# EAGLE design exp21dc (EAGLE 7.7.0)
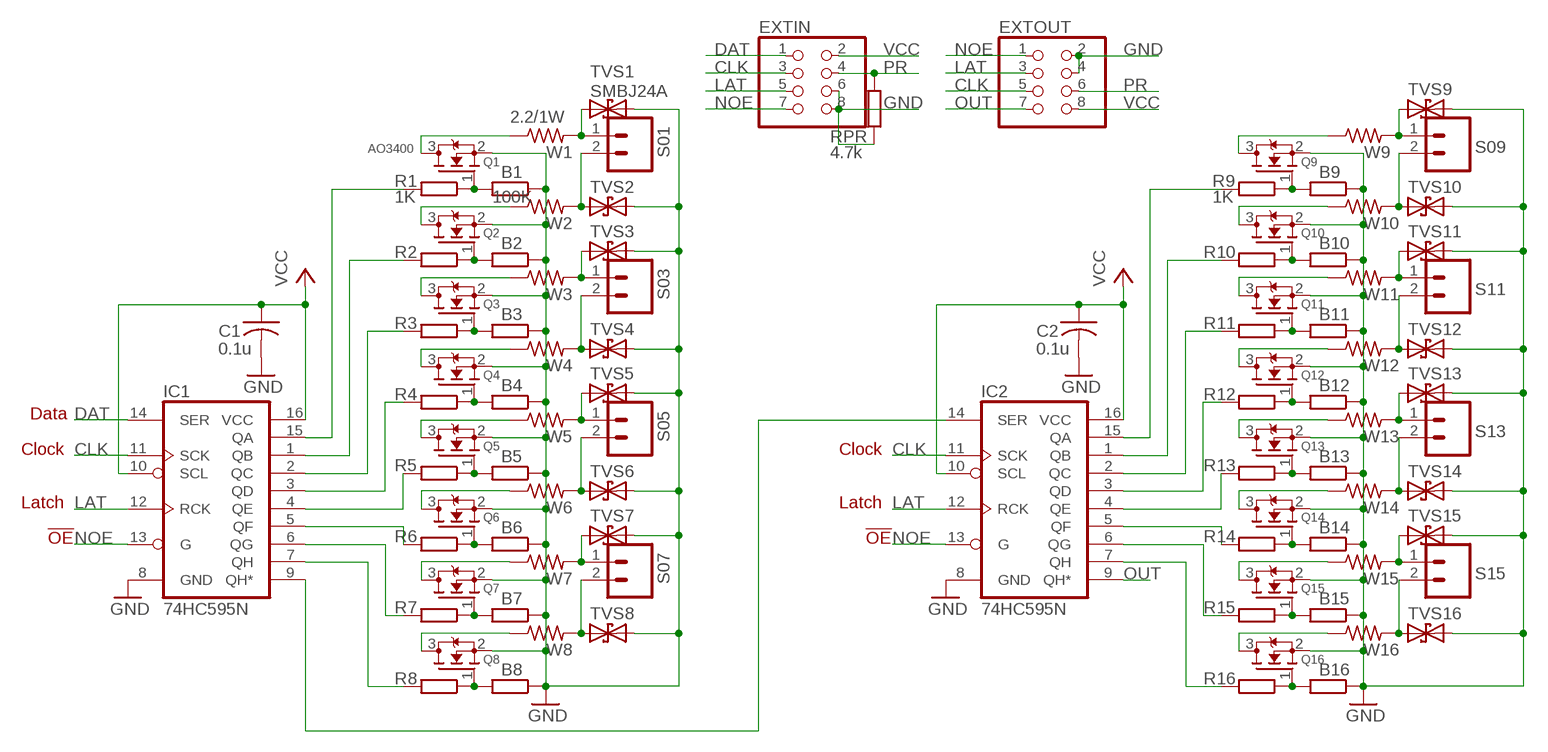
[diagram p0: schematic, sheet 1]

## Parts
B1  100K  R-EU_R0603  [R0603]
B2  100K  R-EU_R0603  [R0603]
B3  100K  R-EU_R0603  [R0603]
B4  100K  R-EU_R0603  [R0603]
B5  100K  R-EU_R0603  [R0603]
B6  100K  R-EU_R0603  [R0603]
B7  100K  R-EU_R0603  [R0603]
B8  100K  R-EU_R0603  [R0603]
B9  100K  R-EU_R0603  [R0603]
B10  100K  R-EU_R0603  [R0603]
B11  100K  R-EU_R0603  [R0603]
B12  100K  R-EU_R0603  [R0603]
B13  100K  R-EU_R0603  [R0603]
B14  100K  R-EU_R0603  [R0603]
B15  100K  R-EU_R0603  [R0603]
B16  100K  R-EU_R0603  [R0603]
C1  0.1u  C-USC0603K  [C0603K]
C2  0.1u  C-USC0603K  [C0603K]
EXTIN  PINHD-2X4/90  [2X04/90]
EXTOUT  PINHD-2X4/90  [2X04/90]
IC1  74HC595N  74LS595D  [SO16]
IC2  74HC595N  74LS595D  [SO16]
Q1  AO3400  MOSFET-NREFLOW  [SOT23]
Q2  MOSFET-NREFLOW  [SOT23]
Q3  MOSFET-NREFLOW  [SOT23]
Q4  MOSFET-NREFLOW  [SOT23]
Q5  MOSFET-NREFLOW  [SOT23]
Q6  MOSFET-NREFLOW  [SOT23]
Q7  MOSFET-NREFLOW  [SOT23]
Q8  MOSFET-NREFLOW  [SOT23]
Q9  MOSFET-NREFLOW  [SOT23]
Q10  MOSFET-NREFLOW  [SOT23]
Q11  MOSFET-NREFLOW  [SOT23]
Q12  MOSFET-NREFLOW  [SOT23]
Q13  MOSFET-NREFLOW  [SOT23]
Q14  MOSFET-NREFLOW  [SOT23]
Q15  MOSFET-NREFLOW  [SOT23]
Q16  MOSFET-NREFLOW  [SOT23]
R1  1K  R-EU_R0603  [R0603]
R2  1K  R-EU_R0603  [R0603]
R3  1K  R-EU_R0603  [R0603]
R4  1K  R-EU_R0603  [R0603]
R5  1K  R-EU_R0603  [R0603]
R6  1K  R-EU_R0603  [R0603]
R7  1K  R-EU_R0603  [R0603]
R8  1K  R-EU_R0603  [R0603]
R9  1K  R-EU_R0603  [R0603]
R10  1K  R-EU_R0603  [R0603]
R11  1K  R-EU_R0603  [R0603]
R12  1K  R-EU_R0603  [R0603]
R13  1K  R-EU_R0603  [R0603]
R14  1K  R-EU_R0603  [R0603]
R15  1K  R-EU_R0603  [R0603]
R16  1K  R-EU_R0603  [R0603]
RPR  4.7k  R-EU_R0603  [R0603]
S01  M025MM-X  [SCREWTERMINAL-5MM-2-X]
S03  M025MM-X  [SCREWTERMINAL-5MM-2-X]
S05  M025MM-X  [SCREWTERMINAL-5MM-2-X]
S07  M025MM-X  [SCREWTERMINAL-5MM-2-X]
S09  M025MM-X  [SCREWTERMINAL-5MM-2-X]
S11  M025MM-X  [SCREWTERMINAL-5MM-2-X]
S13  M025MM-X  [SCREWTERMINAL-5MM-2-X]
S15  M025MM-X  [SCREWTERMINAL-5MM-2-X]
TVS1  SMBJ24A  TVSSMB  [SMB]
TVS2  TVSSMB  [SMB]
TVS3  TVSSMB  [SMB]
TVS4  TVSSMB  [SMB]
TVS5  TVSSMB  [SMB]
TVS6  TVSSMB  [SMB]
TVS7  TVSSMB  [SMB]
TVS8  TVSSMB  [SMB]
TVS9  TVSSMB  [SMB]
TVS10  TVSSMB  [SMB]
TVS11  TVSSMB  [SMB]
TVS12  TVSSMB  [SMB]
TVS13  TVSSMB  [SMB]
TVS14  TVSSMB  [SMB]
TVS15  TVSSMB  [SMB]
TVS16  TVSSMB  [SMB]
W1  2.2/1W  R-US_R2512  [R2512]
W2  R-US_R2512  [R2512]
W3  R-US_R2512  [R2512]
W4  R-US_R2512  [R2512]
W5  R-US_R2512  [R2512]
W6  R-US_R2512  [R2512]
W7  R-US_R2512  [R2512]
W8  R-US_R2512  [R2512]
W9  R-US_R2512  [R2512]
W10  R-US_R2512  [R2512]
W11  R-US_R2512  [R2512]
W12  R-US_R2512  [R2512]
W13  R-US_R2512  [R2512]
W14  R-US_R2512  [R2512]
W15  R-US_R2512  [R2512]
W16  R-US_R2512  [R2512]

## Nets
CLK: EXTIN.3 EXTOUT.5 IC1.11(SCK) IC2.11(SCK)
DAT: EXTIN.1 IC1.14(SER)
GND: B1.1 B2.1 B3.1 B4.1 B5.1 B6.1 B7.1 B8.1 B9.1 B10.1 B11.1 B12.1 B13.1 B14.1 B15.1 B16.1 C1.2 C2.2 EXTIN.6 EXTIN.8 EXTOUT.2 EXTOUT.4 IC1.8(GND) IC2.8(GND) Q1.2(S) Q2.2(S) Q3.2(S) Q4.2(S) Q5.2(S) Q6.2(S) Q7.2(S) Q8.2(S) Q9.2(S) Q10.2(S) Q11.2(S) Q12.2(S) Q13.2(S) Q14.2(S) Q15.2(S) Q16.2(S) RPR.1 TVS1.C TVS2.C TVS3.C TVS4.C TVS5.C TVS6.C TVS7.C TVS8.C TVS9.C TVS10.C TVS11.C TVS12.C TVS13.C TVS14.C TVS15.C TVS16.C
LAT: EXTIN.5 EXTOUT.3 IC1.12(RCK) IC2.12(RCK)
N$1 [power]: S01.1 TVS1.A W1.2
N$2 [power]: S03.1 TVS3.A W3.2
N$3 [power]: S05.1 TVS5.A W5.2
N$4: IC1.5(QF) R6.2
N$5: IC1.6(QG) R7.2
N$6 [power]: S07.1 TVS7.A W7.2
N$7: IC1.7(QH) R8.2
N$8: B1.2 Q1.1(G) R1.1
N$9 [power]: Q1.3(D) W1.1
N$10: IC1.4(QE) R5.2
N$11: IC1.3(QD) R4.2
N$12: IC1.2(QC) R3.2
N$13: IC1.1(QB) R2.2
N$14: IC1.15(QA) R1.2
N$15: B2.2 Q2.1(G) R2.1
N$16 [power]: Q2.3(D) W2.1
N$17 [power]: S01.2 TVS2.A W2.2
N$18: B3.2 Q3.1(G) R3.1
N$19 [power]: Q3.3(D) W3.1
N$20 [power]: S03.2 TVS4.A W4.2
N$21: B4.2 Q4.1(G) R4.1
N$22 [power]: Q4.3(D) W4.1
N$23 [power]: S05.2 TVS6.A W6.2
N$24: IC2.5(QF) R14.2
N$25 [power]: S07.2 TVS8.A W8.2
N$26: IC2.6(QG) R15.2
N$27: IC2.7(QH) R16.2
N$28: IC2.4(QE) R13.2
N$29: IC2.3(QD) R12.2
N$30: IC2.2(QC) R11.2
N$31: IC2.1(QB) R10.2
N$32: IC2.15(QA) R9.2
N$33 [power]: S09.2 TVS10.A W10.2
N$34 [power]: S11.2 TVS12.A W12.2
N$35 [power]: S13.2 TVS14.A W14.2
N$36 [power]: S15.2 TVS16.A W16.2
N$37 [power]: S09.1 TVS9.A W9.2
N$38: S11.1 TVS11.A W11.2
N$39: S13.1 TVS13.A W13.2
N$40: S15.1 TVS15.A W15.2
N$41: B9.2 Q9.1(G) R9.1
N$42: B10.2 Q10.1(G) R10.1
N$43: B11.2 Q11.1(G) R11.1
N$44: B12.2 Q12.1(G) R12.1
N$45: B13.2 Q13.1(G) R13.1
N$46: B14.2 Q14.1(G) R14.1
N$47: B15.2 Q15.1(G) R15.1
N$48: B16.2 Q16.1(G) R16.1
N$49: IC1.9(QH*) IC2.14(SER)
N$50: B5.2 Q5.1(G) R5.1
N$51: B6.2 Q6.1(G) R6.1
N$52: B7.2 Q7.1(G) R7.1
N$53: B8.2 Q8.1(G) R8.1
N$54 [power]: Q5.3(D) W5.1
N$55 [power]: Q6.3(D) W6.1
N$56 [power]: Q7.3(D) W7.1
N$57 [power]: Q8.3(D) W8.1
N$58 [power]: Q9.3(D) W9.1
N$59 [power]: Q10.3(D) W10.1
N$60: Q11.3(D) W11.1
N$61 [power]: Q12.3(D) W12.1
N$62: Q13.3(D) W13.1
N$63 [power]: Q14.3(D) W14.1
N$64: Q15.3(D) W15.1
N$65 [power]: Q16.3(D) W16.1
NOE: EXTIN.7 EXTOUT.1 IC1.13(G) IC2.13(G)
OUT: EXTOUT.7 IC2.9(QH*)
PR: EXTIN.4 EXTOUT.6 RPR.2
VCC: C1.1 C2.1 EXTIN.2 EXTOUT.8 IC1.10(SCL) IC1.16(VCC) IC2.10(SCL) IC2.16(VCC)

## Notes on the sheet
- Data
- Clock | Clock
- Latch | Latch
- !OE | !OE

## Library data of the parts
B1-B16 R1-R16 RPR = rcl:R-EU_: RESISTOR, European symbol
C1 C2 = adafruit2013:C-US: CAPACITOR, American symbol
EXTIN EXTOUT = pinhead:PINHD-2X4: PIN HEADER
IC1 IC2 = SparkFun:74*595: 8-bit SHIFT REGISTER, output latch
Q1-Q16 = adafruit2013:MOSFET-N: N-Channel Mosfet 2N7002E - 60V 260mA SOT23 [Digikey: 2N7002ET1GOSTR-ND] - REEL BSH103 - 30V 850mA SOT23 [Digikey: 568-5013-1-ND]
S01 S03 S05 S07 S09 S11 S13 S15 = SparkFun:M02: Header 2 Standard 2-pin 0.1" header. Use with straight break away headers (SKU : PRT-00116), right angle break away headers (PRT-00553), swiss pins (PRT-00743), machine pins (PRT-00117), and female headers (PRT-00115). Molex polarized connector foot print use with SKU : PRT-08233 with associated crimp pins and housings.
TVS1-TVS16 = SparkFunNew:TVS
W1-W16 = resistor:R-US_: RESISTOR, American symbol

## Net classes
0 default: width 0.254 mm, clearance 0.203 mm
1 power: width 0.508 mm, clearance 0.203 mm

## Board
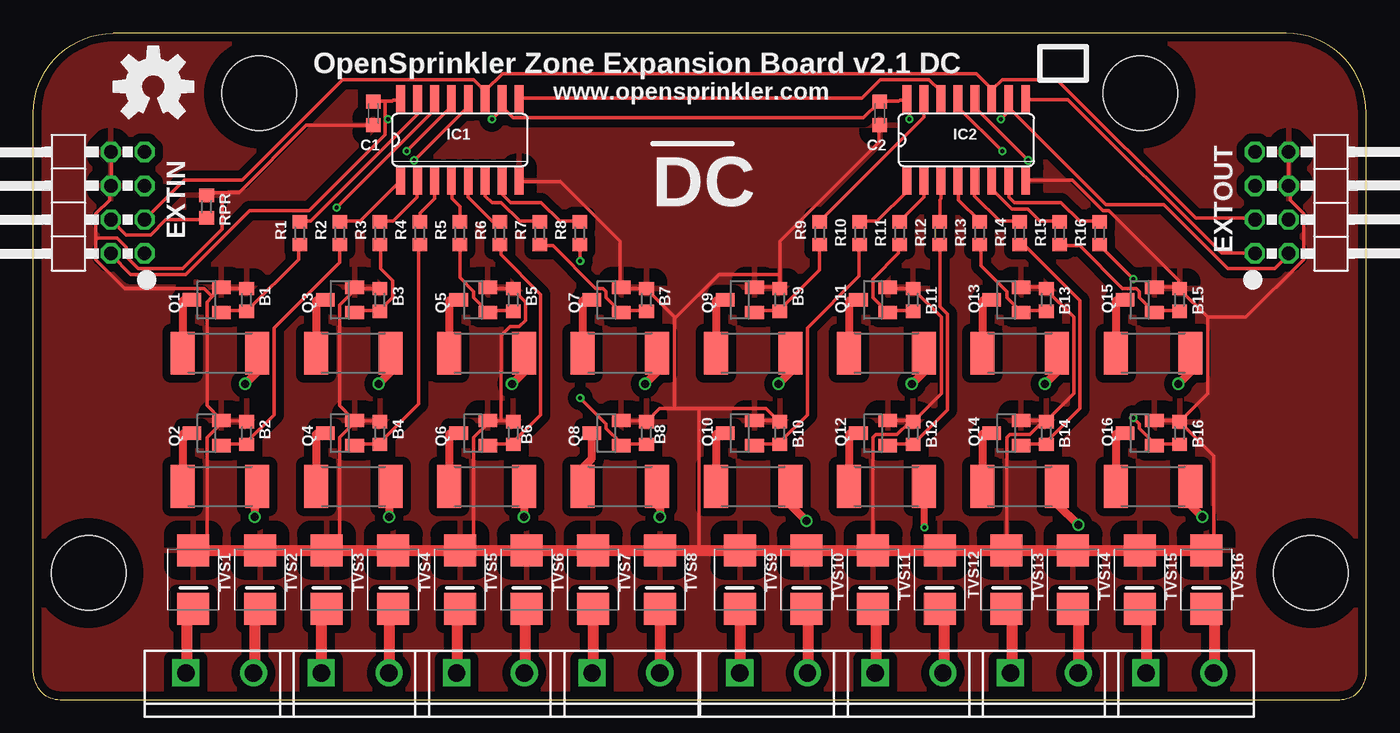
[diagram p1: board, top side]
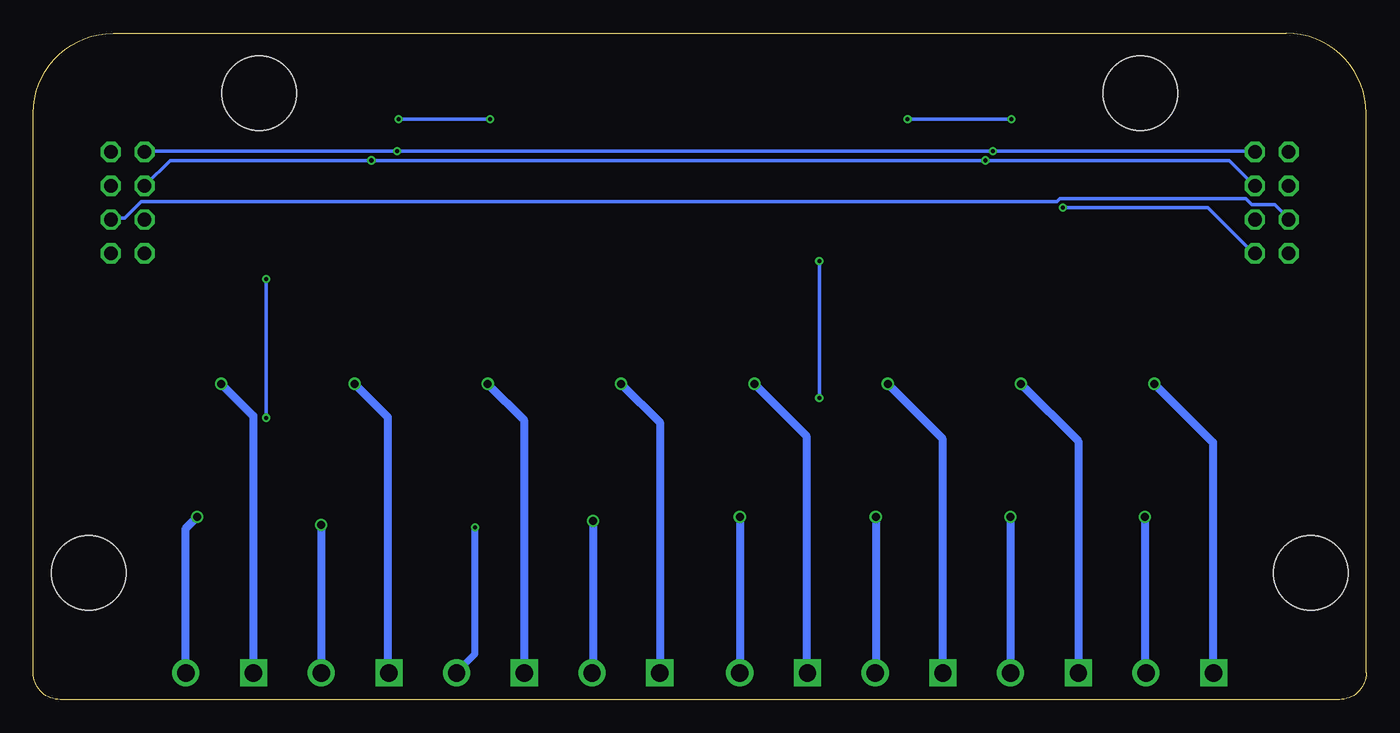
[diagram p2: board, bottom side, seen from below]

Size 100 x 50 mm. Coordinates in mm from the lower left corner, seen from the top.
Outline: 2,0 98,0 arc90 100,2 100,44 arc90 94,50 6,50 arc90 0,44 0,2 arc90 2,0
Copper layers (1*16): Top 0.035mm / dielectric 1.5mm / Bottom 0.035mm
Design rules "Fusion_eagle_rule_v1.1 *": minimum track width 6mil, minimum drill 12mil, track to track 6mil, track to pad 6mil, pad to pad 6mil, via to via 6mil, smd to smd 0mil, copper to edge 10mil, drill to drill 10mil, minimum pad ring 10mil, minimum via ring 6mil, stop-mask expansion 2mil, vias tented up to drill 100mil, thermal gap 40mil
Holes 5.6 mm at 4.14,9.49 95.86,9.49 16.95,45.49 83.06,45.49
tRestrict: area 0.6,6 to 7.6,13; area 92.4,6 to 99.4,13; area 13.4,42 to 20.4,49; area 79.6,42 to 86.6,49

### Footprints (pad centres in the part's own frame; a part is rotated, then mirrored left to right if it is on the bottom)
R0603 = smd 1 x 1.1: 1 -0.85,0; 2 0.85,0
C0603K = smd 1.05 x 1.08: 1 -0.875,0; 2 0.875,0
2X04/90 = drill 1.016 octagon: 1 -3.81,-6.35; 2 -3.81,-3.81; 3 -1.27,-6.35; 4 -1.27,-3.81; 5 1.27,-6.35; 6 1.27,-3.81; 7 3.81,-6.35; 8 3.81,-3.81
SO16 = smd 0.66 x 2.032: 1 -4.445,-3.073; 2 -3.175,-3.073; 3 -1.905,-3.073; 4 -0.635,-3.073; 5 0.635,-3.073; 6 1.905,-3.073; 7 3.175,-3.073; 8 4.445,-3.073; 9 4.445,3.073; 10 3.175,3.073; 11 1.905,3.073; 12 0.635,3.073; 13 -0.635,3.073; 14 -1.905,3.073; 15 -3.175,3.073; 16 -4.445,3.073
SOT23 = smd 1 x 1.4: 1 -0.95,-1.1; 2 0.95,-1.1; 3 0,1.1
SCREWTERMINAL-5MM-2-X = drill 1.3 pad 2.032 square: 1 0,0 | drill 1.3 pad 2.032: 2 5.08,0
SMB = smd 2.4 x 2.4: A 2.2,0; C -2.2,0
R2512 = smd 1.8 x 3.2: 1 -2.8,0; 2 2.8,0

### Placement (x,y rotation side)
B1  16,30 270 top
B2  16,20 270 top
B3  26,30 270 top
B4  26,20 270 top
B5  36,30 270 top
B6  36,20 270 top
B7  46,30 270 top
B8  46,20 270 top
B9  56,30 270 top
B10  56,20 270 top
B11  66,30 270 top
B12  66,20 270 top
B13  76,30 270 top
B14  76,20 270 top
B15  86,30 270 top
B16  86,20 270 top
C1  25.5,44 270 top
C2  63.5,44 270 top
EXTIN  2,37.29 90 top
EXTOUT  98,37.29 270 top
IC1  32,42 0 top
IC2  70,42 0 top
Q1  13,30 90 top
Q2  13,20 90 top
Q3  23,30 90 top
Q4  23,20 90 top
Q5  33,30 90 top
Q6  33,20 90 top
Q7  43,30 90 top
Q8  43,20 90 top
Q9  53,30 90 top
Q10  53,20 90 top
Q11  63,30 90 top
Q12  63,20 90 top
Q13  73,30 90 top
Q14  73,20 90 top
Q15  83,30 90 top
Q16  83,20 90 top
R1  20,35 90 top
R2  23,35 90 top
R3  26,35 90 top
R4  29,35 90 top
R5  32,35 90 top
R6  35,35 90 top
R7  38,35 90 top
R8  41,35 90 top
R9  59,35 90 top
R10  62,35 90 top
R11  65,35 90 top
R12  68,35 90 top
R13  71,35 90 top
R14  74,35 90 top
R15  77,35 90 top
R16  80,35 90 top
RPR  13,37 270 top
S01  11.44,2 0 top
S03  21.6,2 0 top
S05  31.76,2 0 top
S07  41.92,2 0 top
S09  53,2 0 top
S11  63.16,2 0 top
S13  73.32,2 0 top
S15  83.48,2 0 top
TVS1  12,9 270 top
TVS2  17,9 270 top
TVS3  22,9 270 top
TVS4  27,9 270 top
TVS5  32,9 270 top
TVS6  37,9 270 top
TVS7  42,9 270 top
TVS8  47,9 270 top
TVS9  53,9 270 top
TVS10  58,9 270 top
TVS11  63,9 270 top
TVS12  68,9 270 top
TVS13  73,9 270 top
TVS14  78,9 270 top
TVS15  83,9 270 top
TVS16  88,9 270 top
W1  14,26 0 top
W2  14,16 0 top
W3  24,26 0 top
W4  24,16 0 top
W5  34,26 0 top
W6  34,16 0 top
W7  44,26 0 top
W8  44,16 0 top
W9  54,26 0 top
W10  54,16 0 top
W11  64,26 0 top
W12  64,16 0 top
W13  74,26 0 top
W14  74,16 0 top
W15  84,26 0 top
W16  84,16 0 top

### Tracks (layer width: path | path; a pad name or v marks a point on that pad's centre or on a via)
CLK
  Top 0.254: EXTOUT.5 91.55,36.12 87.21,36.12 76.81,46.52 72.69,46.52 72.01,45.83 72.01,45.15 IC2.11 71.89,45.83 70.75,46.98 35.2,46.98 33.95,45.72 IC1.11 33.83,45.15 33.83,45.72 33.03,46.52 23.2,46.52 15.66,38.98 11.32,38.98 8.46,36.12 EXTIN.3
DAT  (via drill 0.3)
  Top 0.254: v22.75,36.92 30.06,44.23 30.06,45.03 IC1.14
  Bottom 0.254: v22.75,36.92 11.89,36.92 8.46,33.49 EXTIN.1
GND
  Top 0.254: 56.01,31.89 56.01,30.86 B9.1 56,30.95 Q9.2 | 56.01,31.89 56.01,34.4 63.44,41.83 63.44,43.09 C2.2 | Q8.2 44.12,20.92 45.95,20.92 B8.1 46.06,20.92 46.98,21.83 48.12,21.83 | 48.12,21.83 49.95,21.83 | 49.95,21.83 54.98,21.83 55.89,20.92 B10.1 56,20.95 Q10.2 | 48.12,28.69 46.06,30.75 B7.1 45.95,30.86 44.12,30.86 Q7.2 44.01,30.98 44.01,34.4 39.55,38.86 36.46,38.86 IC1.8 | 48.12,21.83 48.12,28.69 | 56.01,31.89 51.44,31.89 48.23,28.69 48.12,28.69 | 14.17,38.06 13.03,38.06 RPR.1 | 14.17,38.06 15.43,38.06 20.46,43.09 25.49,43.09 C1.2 | EXTOUT.2 94.18,41.03 94.18,38.63 EXTOUT.4 94.3,38.52 94.3,37.49 95.33,36.46 95.33,33.03 90.98,28.69 88.12,28.69 | EXTIN.8 5.83,41.03 5.83,38.63 EXTIN.6 5.71,38.52 5.71,37.49 4.69,36.46 4.69,34.63 | 74.52,38.98 IC2.8 74.64,38.98 77.95,38.98 80.24,36.69 80.7,36.69 85.95,31.43 85.95,30.86 B15.1 | Q5.2 34.18,30.86 35.89,30.86 B5.1 36.01,30.75 36.92,29.83 36.92,28.46 36.46,28 35.78,28 35.09,27.32 35.09,20.92 | B3.1 25.95,30.86 24.12,30.86 Q3.2 24.12,30.75 22.97,29.6 22.97,22.06 24,21.03 Q4.2 | 35.09,20.92 34.18,20.92 Q6.2 34.18,20.8 33.03,19.66 33.03,11.54 TVS5.C | 35.09,20.92 35.89,20.92 B6.1 | B4.1 25.95,20.92 24.12,20.92 Q4.2 | B1.1 15.89,30.86 14.17,30.86 Q1.2 14.06,30.86 13.43,30.23 | B2.1 15.89,20.92 14.17,20.92 Q2.2 | B12.1 65.95,20.8 65.72,20.8 64.81,19.89 63.21,19.89 62.98,19.66 62.98,11.54 TVS11.C | B14.1 75.89,20.8 75.67,20.8 74.75,19.89 73.27,19.89 73.04,19.66 73.04,11.54 TVS13.C | B16.1 86.07,20.8 88.58,18.29 88.58,12 88.12,11.54 TVS16.C 88.01,11.4 | B12.1 66.06,20.92 68.12,22.97 68.12,28.69 66.06,30.75 B11.1 65.95,30.86 64.12,30.86 Q11.2
  Top 0.254: B14.1 76.01,20.92 78.07,22.97 78.07,28.69 76.01,30.75 B13.1 76,30.95 Q13.2 | 88.12,28.69 86.07,30.75 B15.1 | 88.12,28.69 88.12,22.97 86.07,20.92 B16.1 | Q2.2 14.17,20.8 13.03,19.66 13.03,11.54 TVS1.C | 13.43,30.23 13.03,29.83 13.03,22.06 14.06,21.03 Q2.2 | Q4.2 24.12,20.8 22.97,19.66 22.97,11.54 TVS3.C | 4.69,34.63 4.69,33.03 6.86,30.86 12.8,30.86 13.43,30.23 | 14.17,38.06 14.17,35.32 11.2,32.35 7.89,32.35 6.97,33.26 6.97,33.95 6.29,34.63 4.69,34.63 | 49.95,11.2 49.95,21.83 | Q12.2 66,20.95 B12.1 | Q14.2 76,20.95 B14.1 | Q15.2 86,30.95 B15.1 | Q16.2 86,20.95 B16.1
  Top 0.813: TVS1.C TVS2.C TVS3.C TVS4.C TVS5.C TVS6.C TVS7.C TVS8.C 49.95,11.2 TVS9.C TVS10.C TVS11.C TVS12.C TVS13.C TVS14.C TVS15.C TVS16.C
  pour Top (isolate 0.61): 0,50 100,50 100,0 0,0
LAT  (via drill 0.3)
  Top 0.254: v74.64,40.46 70.64,44.46 70.64,45.03 IC2.12 | v28.57,40.46 32.58,44.46 32.58,45.03 IC1.12
  Bottom 0.254: EXTOUT.3 91.55,38.63 89.72,40.46 v74.64,40.46 v28.57,40.46 10.29,40.46 8.46,38.63 EXTIN.5
N$1  (via drill 0.6)
  Top 0.61: v15.9,23.7 16.8,24.6 W1.2
  Top 0.813: TVS1.A 11.6,6.8 11.5,6.7 11.5,2 S01.1
  Bottom 0.61: v15.9,23.7 11.5,19.3 11.5,2 S01.1
N$2  (via drill 0.6)
  Top 0.61: v25.9,23.7 26.8,24.6 W3.2
  Top 0.813: S03.1 21.6,6.7 21.7,6.8 TVS3.A
  Bottom 0.61: S03.1 21.6,19.4 v25.9,23.7
N$3  (via drill 0.6)
  Top 0.61: v35.9,23.7 36.8,24.6 W5.2
  Top 0.813: TVS5.A 31.9,6.8 31.8,6.7 31.8,2 S05.1
  Bottom 0.61: v35.9,23.7 31.8,19.6 31.8,2 S05.1
N$4
  Top 0.254: R6.2 35,35.9 34.4,35.9 32.6,37.7 32.6,38.9 IC1.5
N$5
  Top 0.254: R7.2 38,35.9 36.5,35.9 35.1,37.3 34.4,37.3 33.9,37.8 33.9,38.9 IC1.6
N$6  (via drill 0.6)
  Top 0.61: v45.9,23.7 46.8,24.6 W7.2
  Top 0.813: TVS7.A 42,2 S07.1
  Bottom 0.61: v45.9,23.7 42,19.8 42,2 S07.1
N$7
  Top 0.254: R8.2 41,35.9 39.5,35.9 38.1,37.3 35.8,37.3 35.2,37.9 35.2,38.9 IC1.7
N$8
  Top 0.254: Q1.1 14.1,29.1 14.5,29.1 14.6,29.2 16,29.2 B1.2 16.12,29.26 19.89,33.03 19.89,34.06 R1.1
N$9
  Top 0.61: W1.1 11.2,29.9 11.3,30 Q1.3
N$10
  Top 0.254: R5.2 32,37 31.4,37.6 31.4,38.9 IC1.4
N$11
  Top 0.254: R4.2 29,36.5 30.1,37.6 30.1,38.9 IC1.3
N$12
  Top 0.254: R3.2 26,35.9 27,35.9 28.8,37.7 28.8,38.9 IC1.2
N$13
  Top 0.254: R2.2 23,35.9 24.5,35.9 27.5,38.9 IC1.1
N$14
  Top 0.254: R1.2 20,35.9 20.8,35.9 28.8,43.9 28.8,45 IC1.15
N$15
  Top 0.254: Q2.1 14.1,19.1 14.5,19.1 14.6,19.2 16,19.2 B2.2 16,19.32 18.06,21.37 18.06,27.89 22.97,32.8 22.97,34.06 R2.1
N$16
  Top 0.61: W2.1 11.2,19.9 11.3,20 Q2.3
N$17  (via drill 0.6)
  Top 0.61: v16.6,13.7 16.6,14.4 16.8,14.6 W2.2
  Top 0.813: TVS2.A 16.7,6.8 16.6,6.7 16.6,2 S01.2
  Bottom 0.61: v16.6,13.7 16.6,2 S01.2
N$18
  Top 0.254: Q3.1 24.1,29.1 24.5,29.1 24.6,29.2 26,29.2 B3.2 26.06,29.26 26.98,30.18 26.98,31.43 26.06,32.35 26.06,34.06 R3.1
N$19
  Top 0.61: W3.1 21.2,29.9 21.3,30 Q3.3
N$20  (via drill 0.6)
  Top 0.61: v26.7,13.7 26.7,14.5 26.8,14.6 W4.2
  Top 0.813: TVS4.A 26.8,6.8 26.7,6.7 26.7,2 S03.2
  Bottom 0.61: v26.7,13.7 26.7,2 S03.2
N$21
  Top 0.254: Q4.1 24.1,19.1 24.5,19.1 24.6,19.2 26,19.2 B4.2 26.06,19.32 28.92,22.17 28.92,34.06 R4.1
N$22
  Top 0.61: W4.1 21.2,19.9 21.3,20 Q4.3
N$23  (via drill 0.6)
  Top 0.61: W6.2 v36.8,13.7
  Top 0.813: TVS6.A 36.9,6.8 36.9,2 S05.2
  Bottom 0.61: v36.8,13.7 36.8,2 S05.2
N$24
  Top 0.254: R14.2 74,35.9 72.5,35.9 70.6,37.8 70.6,38.9 IC2.5
N$25  (via drill 0.6)
  Top 0.61: v47,13.7 47,14.4 46.8,14.6 W8.2
  Top 0.813: TVS8.A S07.2
  Bottom 0.61: v47,13.7 S07.2
N$26
  Top 0.254: R15.2 77,35.9 75.5,35.9 74.6,36.8 73.4,36.8 71.9,38.3 71.9,38.9 IC2.6
N$27
  Top 0.254: R16.2 80,35.9 78.5,35.9 77.1,37.3 73.6,37.3 73.2,37.7 73.2,38.9 IC2.7
N$28
  Top 0.254: R13.2 71,35.9 69.4,37.5 69.4,38.9 IC2.4
N$29
  Top 0.254: R12.2 68,37.5 68.1,37.6 68.1,38.9 IC2.3
N$30
  Top 0.254: R11.2 65,35.9 66.8,37.7 66.8,38.9 IC2.2
N$31
  Top 0.254: R10.2 62,35.9 63.3,35.9 65.6,38.2 65.6,38.9 IC2.1
N$32
  Top 0.254: R9.2 59,35.9 66.8,43.7 66.8,45 IC2.15
N$33  (via drill 0.6)
  Top 0.61: v58,13.4 56.8,14.6 W10.2
  Top 0.813: TVS10.A 58.1,6.8 58.1,2 S09.2
  Bottom 0.61: v58,13.4 58,2 S09.2
N$34  (via drill 0.3)
  Top 0.508: v66.86,12.92 66.86,15.89 W12.2
  Top 0.813: TVS12.A 68.2,6.8 68.3,6.7 68.3,2 S11.2
  Bottom 0.508: v66.86,12.92 66.86,3.43 68.24,2.06 S11.2
N$35  (via drill 0.6)
  Top 0.61: v78.4,13.1 76.8,14.7 W14.2
  Top 0.813: S13.2 78.4,6.7 78.3,6.8 TVS14.A
  Bottom 0.61: v78.4,13.1 S13.2
N$36  (via drill 0.6)
  Top 0.61: v87.7,13.7 86.8,14.6 W16.2
  Top 0.813: TVS16.A 88.5,6.8 88.6,6.7 88.6,2 S15.2
  Bottom 0.61: v87.7,13.7 88.6,12.8 88.6,2.04 S15.2
N$37  (via drill 0.6)
  Top 0.61: v55.9,23.7 56.8,24.6 W9.2
  Top 0.813: TVS9.A S09.1
  Bottom 0.61: S09.1 53,20.8 v55.9,23.7
N$38  (via drill 0.6)
  Top 0.61: v65.9,23.7 66.8,24.6 W11.2
  Top 0.813: TVS11.A 63.1,6.8 63.2,6.7 63.2,2 S11.1
  Bottom 0.61: v65.9,23.7 63.2,21 63.2,2 S11.1
N$39  (via drill 0.6)
  Top 0.61: v75.9,23.7 76.8,24.6 W13.2
  Top 0.813: TVS13.A 73.3,6.8 73.4,6.7 73.4,2 S13.1
  Bottom 0.61: v75.9,23.7 73.4,21.2 73.4,2 S13.1
N$40  (via drill 0.6)
  Top 0.61: v85.9,23.7 86.8,24.6 W15.2
  Top 0.813: TVS15.A 83.4,6.8 83.5,6.7 83.5,2 S15.1
  Bottom 0.61: v85.9,23.7 83.5,21.3 83.5,2 S15.1
N$41
  Top 0.254: Q9.1 54.1,29.1 54.5,29.1 54.6,29.2 56,29.2 B9.2 56.01,29.26 58.98,32.23 58.98,34.06 R9.1
N$42
  Top 0.254: Q10.1 54.1,19.1 54.5,19.1 54.6,19.2 56,19.2 B10.2 56.01,19.32 58.06,21.37 58.06,27.89 61.95,31.77 61.95,34.06 R10.1
N$43
  Top 0.254: B11.2 66,29.2 64.6,29.2 64.5,29.1 64.1,29.1 Q11.1 64.01,29.15 62.98,30.18 62.98,31.55 64.92,33.49 64.92,34.06 R11.1
N$44
  Top 0.254: Q12.1 64.1,19.1 64.5,19.1 64.6,19.2 66,19.2 B12.2 66.06,19.2 68.58,21.72 68.58,28.92 68.01,29.49 68.01,34.06 R12.1
N$45
  Top 0.254: B13.2 76,29.2 74.6,29.2 74.5,29.1 74.1,29.1 Q13.1 74.07,29.15 73.04,30.18 73.04,30.63 71.09,32.58 71.09,34.06 R13.1
N$46
  Top 0.254: Q14.1 74.1,19.1 74.5,19.1 74.6,19.2 76,19.2 B14.2 76.01,19.32 78.52,21.83 78.52,29.95 74.41,34.06 74.07,34.06 R14.1
N$47
  Top 0.254: B15.2 86,29.2 84.6,29.2 84.5,29.1 84.1,29.1 Q15.1 84.01,29.15 82.98,30.18 82.98,30.63 82.75,30.86 81.72,30.86 78.52,34.06 77.04,34.06 R15.1
N$48  (via drill 0.3)
  Top 0.254: B16.2 86,19.2 84.6,19.2 84.5,19.1 84.1,19.1 Q16.1 84.12,19.2 82.98,20.34 82.98,20.69 v82.53,21.14 | v82.53,31.55 80.01,34.06 R16.1
  Bottom 0.254: v82.53,21.14 v82.53,31.55
N$49
  Top 0.254: IC1.9 36.46,45.15 62.18,45.15 63.55,46.52 67.21,46.52 68.01,45.72 68.01,45.15 IC2.14
N$50
  Top 0.254: B5.2 36,29.2 34.6,29.2 34.5,29.1 34.1,29.1 Q5.1 34.06,29.15 33.03,30.18 33.03,30.63 32,31.66 32,34.06 R5.1
N$51
  Top 0.254: Q6.1 34.1,19.1 34.5,19.1 34.6,19.2 36,19.2 B6.2 36.01,19.32 38.06,21.37 38.06,30.4 35.09,33.38 35.09,34.06 R6.1
N$52
  Top 0.254: B7.2 46,29.2 44.6,29.2 44.5,29.1 44.1,29.1 Q7.1 44.01,29.15 42.98,30.18 42.98,30.63 42.75,30.86 42.18,30.86 38.98,34.06 38.06,34.06 R7.1
N$53  (via drill 0.3)
  Top 0.254: B8.2 46,19.2 44.6,19.2 44.5,19.1 44.1,19.1 Q8.1 44.12,19.2 42.98,20.34 42.98,20.69 v41.03,22.63 | v41.03,32.92 41.03,34.06 R8.1
  Bottom 0.254: v41.03,22.63 v41.03,32.92
N$54
  Top 0.61: W5.1 31.2,29.9 31.3,30 Q5.3
N$55
  Top 0.61: W6.1 31.2,19.9 31.3,20 Q6.3
N$56
  Top 0.61: W7.1 41.2,29.9 41.3,30 Q7.3
N$57
  Top 0.61: Q8.3 41.9,18.1 41.2,17.4 W8.1
N$58
  Top 0.61: W9.1 51.2,29.9 51.3,30 Q9.3
N$59
  Top 0.61: W10.1 51.2,19.9 51.3,20 Q10.3
N$60
  Top 0.61: W11.1 61.2,29.9 61.3,30 Q11.3
N$61
  Top 0.61: W12.1 61.2,19.9 61.3,20 Q12.3
N$62
  Top 0.61: W13.1 71.2,29.9 71.3,30 Q13.3
N$63
  Top 0.61: W14.1 71.2,19.9 71.3,20 Q14.3
N$64
  Top 0.61: W15.1 81.2,29.9 81.3,30 Q15.3
N$65
  Top 0.61: W16.1 81.2,19.9 81.3,20 Q16.3
NOE  (via drill 0.3)
  Top 0.254: v72.69,41.15 69.38,44.46 69.38,45.03 IC2.13 | v28,41.15 31.32,44.46 31.32,45.03 IC1.13
  Bottom 0.254: EXTOUT.1 91.55,41.15 v72.69,41.15 v28,41.15 8.46,41.15 EXTIN.7
OUT
  Top 0.254: IC2.9 74.52,45.03 77.61,45.03 89.15,33.49 91.55,33.49 EXTOUT.7
PR
  Top 0.254: RPR.2 12.92,36.01 9.94,36.01 8.8,34.86 6.97,34.86 5.83,36.01 EXTIN.4
  Bottom 0.254: EXTOUT.6 94.18,36.12 93.15,36.12 91.9,37.38 23.2,37.38 22.97,37.6 9.03,37.6 8.57,37.15 6.86,37.15 5.83,36.12 EXTIN.4
VCC  (via drill 0.3)
  Top 0.254: 26.4,44.9 25.5,44.9 C1.1 | 26.4,44.9 26.9,44.9 27,45 27.5,45 IC1.16 | EXTOUT.8 94.18,33.38 93.15,32.35 89.61,32.35 84.81,37.15 80.47,37.15 73.27,44.35 73.27,45.03 IC2.10 73.27,44.23 v72.58,43.55 | 26.4,43.55 26.4,42.41 20.69,36.69 16.23,36.69 11.43,31.89 7.32,31.89 5.83,33.38 EXTIN.2 | 26.4,43.55 26.4,44.9 | v34.4,43.55 35.2,44.35 IC1.10 35.2,45.03 35.2,44.46 36.01,43.66 62.29,43.66 63.44,44.81 C2.1 63.5,44.9 64.9,44.9 65,45 65.5,45 IC2.16 65.49,44.92 65.72,44.69 v65.72,43.55 | v26.63,43.55 26.4,43.55
  Bottom 0.254: v26.63,43.55 v34.4,43.55 | v65.72,43.55 v72.58,43.55

### Text on the board
tNames: OpenSprinkler Zone Expansion Board v2.1 DC | www.opensprinkler.com | DC